# EAGLE design wgm110_dongle_v10 (EAGLE 7.7.0)
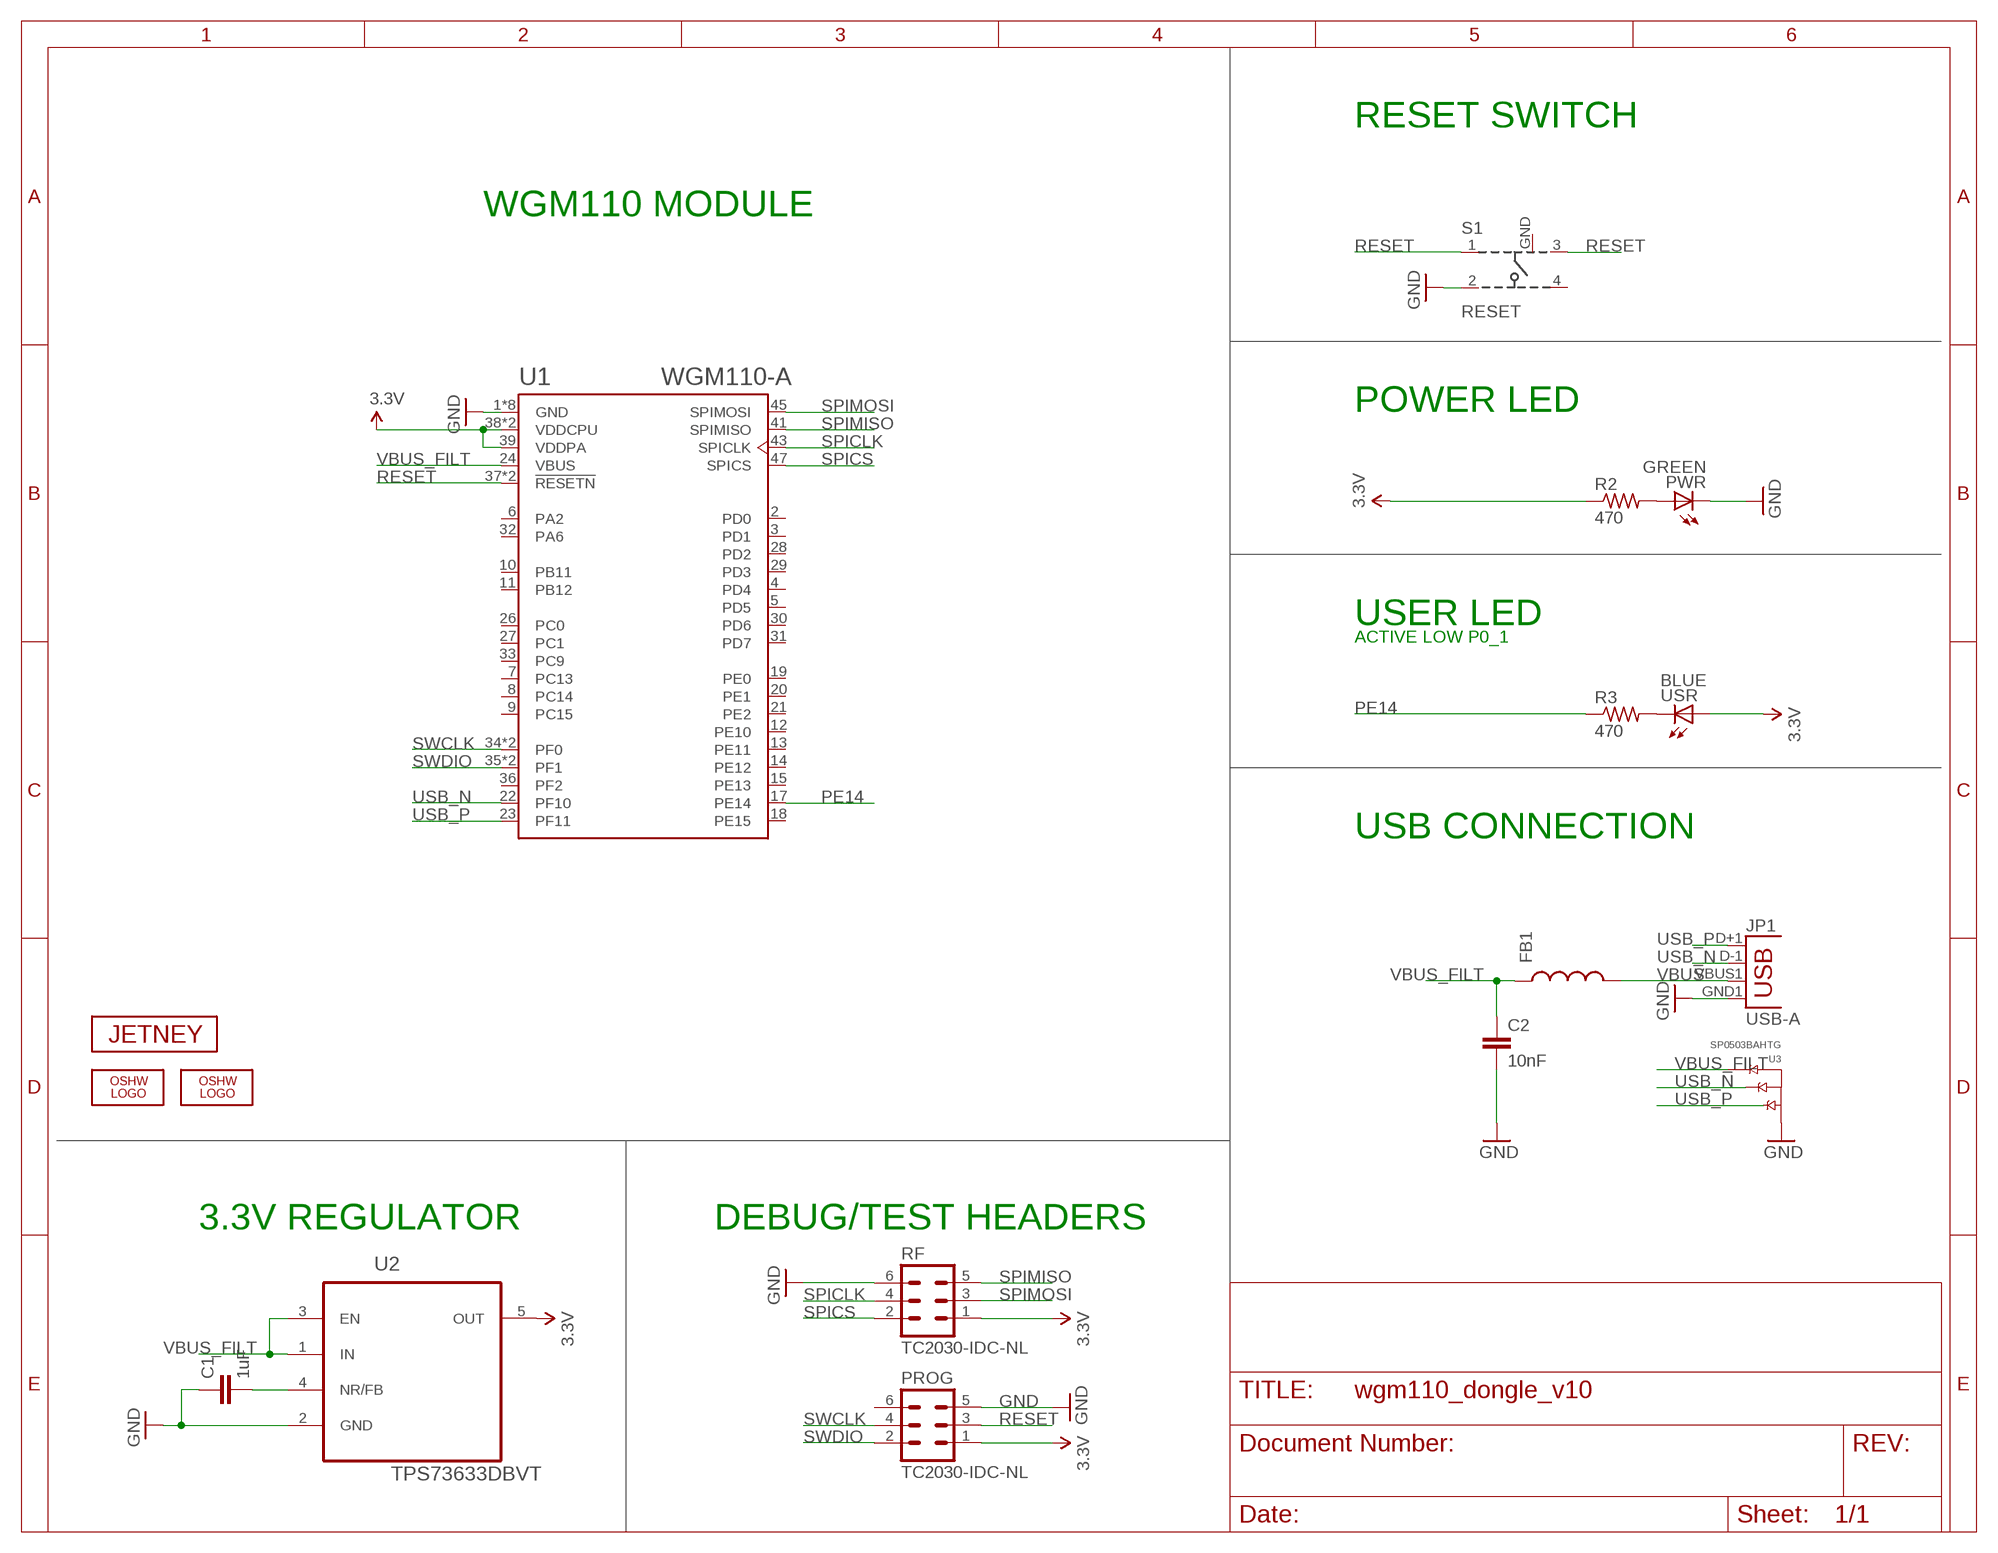
[diagram p0: schematic, sheet 1]

## Parts
C1  1uF  CAP0603-CAP  [0603-CAP]
C2  10nF  CAP0603-CAP  [0603-CAP]
FB1  INDUCTOR0805  [0805]
JP1  USB-A  USBA-SMD-MALE-MOLEX  [USB-A-SMT-MALE-MOLEX]
LOGO1  OSHW_LOGO_FILLX0100-NT  [OSHW_FILLX100_NOTEXT]
LOGO2  OSHW_LOGO_FILLX0070-NT  [OSHW_FILLX70_NOTEXT]
PROG  TC2030-IDC-NL  [TC2030-IDC-NL]
PWR  GREEN  LEDCHIPLED_0805  [CHIPLED_0805]
R2  470  R-US_R0603  [R0603]
R3  470  R-US_R0603  [R0603]
RF  TC2030-IDC-NL  [TC2030-IDC-NL]
S1  RESET  101-IG  [101-IG]
U1  WGM110-A  [WGM110-A]
U2  TPS73633DBVT  [SOT95P280X145-5N]
U3  SP0503BAHTG  [SOT143]
U$2  JETNEY-LOGO-12  [JETNEY-LOGO-12]
USR  BLUE  LEDCHIPLED_0805  [CHIPLED_0805]

## Nets
3.3V [power]: PROG.1 R2.1 RF.1 U1.38(VDDCPU) U1.39(VDDPA) U1.51(VDDCPU) U2.5(OUT) USR.A
GND [power]: C1.1 C2.2 JP1.GND1(GND) PROG.5 PWR.C RF.6 S1.2 U1.1(GND) U1.16(GND) U1.25(GND) U1.40(GND) U1.42(GND) U1.44(GND) U1.46(GND) U1.48(GND) U2.2(GND) U3.1(GND)
PE14: R3.1 U1.17(PE14)
PE14_LED: R3.2 USR.C
PWR_LED: PWR.A R2.2
REG_BP: C1.2 U2.4(NR/FB)
RESET: PROG.3 S1.1 S1.3 U1.37(!RESETN) U1.49(!RESETN)
SPICLK: RF.4 U1.43(SPICLK)
SPICS: RF.2 U1.47(SPICS)
SPIMISO: RF.5 U1.41(SPIMISO)
SPIMOSI: RF.3 U1.45(SPIMOSI)
SWCLK: PROG.4 U1.34(PF0) U1.50(PF0)
SWDIO: PROG.2 U1.35(PF1) U1.52(PF1)
USB_N: JP1.D-1(D-) U1.22(PF10) U3.3(B)
USB_P: JP1.D+1(D+) U1.23(PF11) U3.2(A)
VBUS: FB1.2 JP1.VBUS1(VBUS)
VBUS_FILT: C2.1 FB1.1 U1.24(VBUS) U2.1(IN) U2.3(EN) U3.4(C)
Unconnected: PROG.6 S1.4 U1.2(PD0) U1.3(PD1) U1.4(PD4) U1.5(PD5) U1.6(PA2) U1.7(PC13) U1.8(PC14) U1.9(PC15) U1.10(PB11) U1.11(PB12) U1.12(PE10) U1.13(PE11) U1.14(PE12) U1.15(PE13) U1.18(PE15) U1.19(PE0) U1.20(PE1) U1.21(PE2) U1.26(PC0) U1.27(PC1) U1.28(PD2) U1.29(PD3) U1.30(PD6) U1.31(PD7) U1.32(PA6) U1.33(PC9) U1.36(PF2)

## Notes on the sheet
- RESET SWITCH
- WGM110 MODULE
- POWER LED
- USER LED
- ACTIVE LOW P0_1
- USB CONNECTION
- 3.3V REGULATOR | DEBUG/TEST HEADERS

## Power pins joined to a net without a drawn wire
GND: S1.GND

## Library data of the parts
C1 C2 = SparkFun:CAP: Capacitor Standard 0603 ceramic capacitor, and 0.1" leaded capacitor.
FB1 = SparkFun-Passives:INDUCTOR: Inductors Basic Inductor/Choke - 0603 and 1206. Footprints are not proven and vary greatly between part numbers. INDUCTOR POWER 3.3UH 4.0A SMD 0.197" L x 0.197" W x 0.177" H (5.00mm x 5.00mm x 4.50mm)
JP1 = SparkFun-Connectors:USB: USB Connectors USB-B-PTH is fully proven SKU : PRT-00139/CONN-08278 USB-miniB is fully proven SKU : PRT-00587 USB-A-PCB is untested. USB-A-H is throughly reviewed, but untested. Spark Fun Electronics SKU : PRT-00437 USB-B-SMT is throughly reviewed, but untested. Needs silkscreen touching up. USB-A-S has not been used/tested USB-MB-H has not been used/tested USB-MICROB has been used. CONN-09505
LOGO1 LOGO2 = oshw-logo:OSHW_LOGO_FILL
PROG RF = TagConnect:TC2030-IDC: Tag-Connect In Circuit Programming & Debug Cable 6 Pin http://www.tag-connect.com
PWR USR = led:LED: LED OSRAM: - CHIPLED LG R971, LG N971, LY N971, LG Q971, LY Q971, LO R971, LY R971 LH N974, LH R974 LS Q976, LO Q976, LY Q976 LO Q996 - Hyper CHIPLED LW Q18S LB Q993, LB Q99A, LB R99A - SideLED LS A670, LO A670, LY A670, LG A670, LP A670 LB A673, LV A673, LT A673, LW A673 LH A674 LY A675 LS A676, LA A676, LO A676, LY A676, LW A676 LS A679, LY A679, LG A679 - Hyper Micro SIDELED® LS Y876, LA Y876, LO Y876, LY Y876 LT Y87S - SmartLED LW L88C, LW L88S LB L89C, LB L89S, LG L890 LS L89K, LO L89K, LY L89K LS L896, LA L896, LO L896, LY L896 - TOPLED LS T670, LO T670, LY T670, LG T670, LP T670 LSG T670, LSP T670, LSY T670, LOP T670, LYG T670 LG T671, LOG T671, LSG T671 LB T673, LV T673, LT T673, LW T673 LH T674 LS T676, LA T676, LO T676, LY T676, LB T676, LH T676, LSB T676, LW T676 LB T67C, LV T67C, LT T67C, LS T67K, LO T67K, LY T67K, LW E67C LS E67B, LA E67B, LO E67B, LY E67B, LB E67C, LV E67C, LT E67C LW T67C LS T679, LY T679, LG T679 LS T770, LO T770, LY T770, LG T770, LP T770 LB T773, LV T773, LT T773, LW T773 LH T774 LS E675, LA E675, LY E675, LS T675 LS T776, LA T776, LO T776, LY T776, LB T776 LHGB T686 LT T68C, LB T68C - Hyper Mini TOPLED® LB M676 - Mini TOPLED Santana® LG M470 LS M47K, LO M47K, LY M47K Source: http://www.osram.convergy.de LUXEON: - LUMILED® LXK2-PW12-R00, LXK2-PW12-S00, LXK2-PW14-U00, LXK2-PW14-V00 LXK2-PM12-R00, LXK2-PM12-S00, LXK2-PM14-U00 LXK2-PE12-Q00, LXK2-PE12-R00, LXK2-PE12-S00, LXK2-PE14-T00, LXK2-PE14-U00 LXK2-PB12-K00, LXK2-PB12-L00, LXK2-PB12-M00, LXK2-PB14-N00, LXK2-PB14-P00, LXK2-PB14-Q00 LXK2-PR12-L00, LXK2-PR12-M00, LXK2-PR14-Q00, LXK2-PR14-R00 LXK2-PD12-Q00, LXK2-PD12-R00, LXK2-PD12-S00 LXK2-PH12-R00, LXK2-PH12-S00 LXK2-PL12-P00, LXK2-PL12-Q00, LXK2-PL12-R00 Source: www.luxeon.com KINGBRIGHT: KA-3528ASYC Source: www.kingbright.com
R2 R3 = resistor:R-US_: RESISTOR, American symbol
S1 = sf-keyglove:101-IG
U1 = jetney-silabs-modules:WGM110-A
U2 = TexasInstruments:TPS73633DBVT: Cap-Free, NMOS, 400mA Low-Dropout Regulator with Reverse Current Protection; MPN: TPS73633DBVT; OC_FARNELL: 1535775; OC_NEWARK: 87H2981; PACKAGE: SOT-23-5; SUPPLIER: Texas Instruments
U3 = littlefuse:SP0503BAHTG
U$2 = sf-keyglove:JETNEY-LOGO

## Net classes
0 default: width 0.152 mm, drill 0.33 mm, clearance 0.152 mm
1 power: width 0.254 mm, drill 0.33 mm, clearance 0.152 mm

## Board
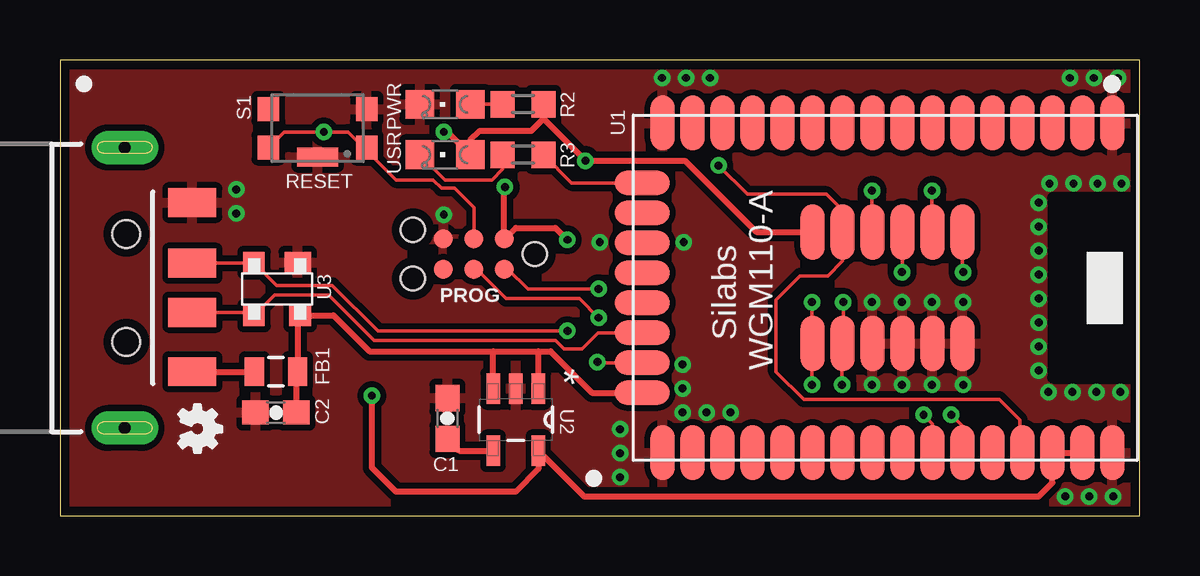
[diagram p1: board, top side]
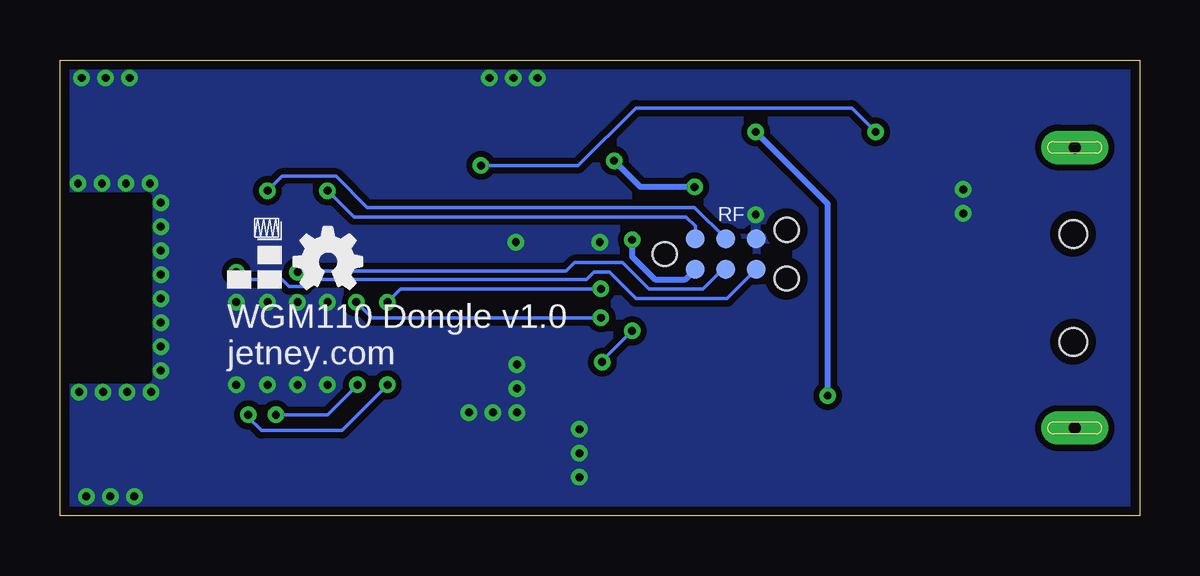
[diagram p2: board, bottom side, seen from below]

Size 45 x 19 mm. Coordinates in mm from the lower left corner, seen from the top.
Outline: 0,0 45,0 45,19 0,19 0,0
Copper layers (1*16): Top 0.0356mm / dielectric 1.5011mm / Bottom 0.0356mm
Design rules "default": minimum track width 6mil, minimum drill 13mil, track to track 6mil, track to pad 6mil, pad to pad 6mil, via to via 6mil, smd to smd 6mil, copper to edge 15mil, drill to drill 6mil, minimum pad ring 7mil, minimum via ring 7mil, stop-mask expansion 4mil, vias tented up to drill 13mil, thermal gap 10mil

### Footprints (pad centres in the part's own frame; a part is rotated, then mirrored left to right if it is on the bottom)
0603-CAP = smd 1.1 x 1: 1 -0.85,0; 2 0.85,0
0805 = smd 0.8 x 1.2: 1 -0.9,0; 2 0.9,0
USB-A-SMT-MALE-MOLEX = smd 1.2 x 2: D+1 1.027,-5.87; D-1 -1.027,-5.87; GND1 3.551,-5.87; VBUS1 -3.5,-5.87 | drill 0.5 pad 1.4 long: P$1 5.85,-3.05; P$3 -5.85,-3.05 | hole 1.15: 2.25,-3.12; -2.25,-3.12
TC2030-IDC-NL = smd 0.787 x 0.787: 1 -1.27,-0.635; 2 -1.27,0.635; 3 0,-0.635; 4 0,0.635; 5 1.27,-0.635; 6 1.27,0.635 | hole 0.991: -2.54,0; 2.54,1.016; 2.54,-1.016
CHIPLED_0805 = smd 1.2 x 1.2: A 0,-1.05; C 0,1.05
R0603 = smd 1 x 1.1: 1 -0.85,0; 2 0.85,0
101-IG = smd 0.9 x 1: 1 -2.05,0.8; 2 -2.05,-0.8; 3 2.05,0.8; 4 2.05,-0.8 | smd 1.7 x 0.8: GND 0,1.2
WGM110-A = smd 2.3 x 1: 1 -6.875,9.47; 2 -6.875,8.22; 3 -6.875,6.97; 4 -6.875,5.72; 5 -6.875,4.47; 6 -6.875,3.22; 7 -6.875,1.97; 8 -6.875,0.72; 9 -6.875,-0.53; 10 -6.875,-1.78; 11 -6.875,-3.03; 12 -6.875,-4.28; 13 -6.875,-5.53; 14 -6.875,-6.78; 15 -6.875,-8.03; 16 -6.875,-9.28; 25 6.875,-9.28; 26 6.875,-8.03; 27 6.875,-6.78; 28 6.875,-5.53; 29 6.875,-4.28; 30 6.875,-3.03; 31 6.875,-1.78; 32 6.875,-0.53; 33 6.875,0.72; 34 6.875,1.97; 35 6.875,3.22; 36 6.875,4.47; 37 6.875,5.72; 38 6.875,6.97; 39 6.875,8.22; 40 6.875,9.47; 41 -2.325,3.22; 42 2.325,3.22; 43 -2.325,1.97; 44 2.325,1.97; 45 -2.325,0.72; 46 2.325,0.72; 47 -2.325,-0.53; 48 2.325,-0.53; 49 -2.325,-1.78; 50 2.325,-1.78; 51 -2.325,-3.03; 52 2.325,-3.03 | smd 1 x 2.3: 17 -4.375,-10.13; 18 -3.125,-10.13; 19 -1.875,-10.13; 20 -0.625,-10.13; 21 0.625,-10.13; 22 1.875,-10.13; 23 3.125,-10.13; 24 4.375,-10.13
SOT95P280X145-5N = smd 1.27 x 0.559: 1 -1.295,0.94; 2 -1.295,0; 3 -1.295,-0.94; 4 1.295,-0.94; 5 1.295,0.94
SOT143 = smd 0.9 x 1.1: 1 -1.1,0.86 | smd 0.9 x 0.9: 2 -1.1,-0.96; 3 1.1,-0.96; 4 1.1,0.96

### Placement (x,y rotation side)
C1  16.15,4.05 270 top
C2  9,4.3 180 top
FB1  9,6 180 top
JP1  -0.35,9.5 90 top
LOGO1  35.24,9.46 0 bottom
LOGO2  4.96,4.61 270 top
PROG  17.25,10.9 180 top
PWR  16.05,17.15 90 top
R2  19.3,17.15 180 top
R3  19.3,15.05 180 top
RF  17.25,10.9 0 bottom
S1  10.74,16.15 180 top
U1  34.4,9.5 270 top
U2  19,4 270 top
U3  9.05,9.45 270 top
U$2  38.04,9.46 0 bottom
USR  16.05,15.05 90 top

### Tracks (layer width: path | path; a pad name or v marks a point on that pad's centre or on a via)
3.3V  (via drill 0.33)
  Top 0.254: U1.39 U1.38 41.37,1.37 40.8,0.8 21.84,0.8 U2.5 19.94,1.94 19,1 14,1 13,2 v13,5 | 20.15,16.55 19.65,16.05 17.5,16.05 17.1,15.65 USR.A 16.15,16 v16,16 | 20.15,16.55 R2.1 | 20.15,16.55 v21.9,14.8 26.05,14.8 29.02,11.82 U1.51 | v18.55,13.7 18.52,13.67 PROG.1 18.54,11.54 19,12 20.65,12 v21.15,11.5
  Bottom 0.254: 22,14.7 v21.9,14.8 20.8,13.7 v18.55,13.7 | v13,5 13,13 v16,16 | v21.15,11.5 21.15,10.8 20.2,9.85 18.93,9.85 RF.1
GND  (via drill 0.33)
  other vias: 23.35,2.6 23.35,3.6 23.35,1.6 7.35,13.6 7.35,12.6 44.25,13.85 43.25,13.85 42.25,13.85 41.25,13.85 40.8,13.05 40.8,12.05 40.8,11.05 40.8,10.05 40.8,9.05 40.8,8.05 40.8,7.05 40.8,6.05 41.2,5.15 42.2,5.15 43.2,5.15 44.2,5.15 25.95,4.3 26.95,4.3 27.95,4.3 25.95,5.3 25.95,6.3 25.1,18.25 26.1,18.25 27.1,18.25 44.1,18.25 43.1,18.25 42.1,18.25 43.9,0.8 42.9,0.8 41.9,0.8 37.65,8.9 36.35,8.9 35.1,8.9 33.85,8.9 37.65,5.45 36.35,5.45 35.1,5.45 33.85,5.45 26,11.4 22.5,11.4 16,12.55
  pour Bottom (isolate 0.254): 0,0 45,0 45,19 0,19
  pour Top (isolate 0.254): 0,0 45,0 45,19 0,19
PE14
  Top 0.152: R3.1 21.32,13.88 U1.17
PE14_LED
  Top 0.152: USR.C 16.05,14 18,14 18.45,14.45 R3.2
PWR_LED
  Top 0.152: PWR.A R2.2
REG_BP
  Top 0.254: C1.2 16.64,2.71 U2.4
RESET  (via drill 0.33)
  Top 0.152: U1.37 40,2.75 40,4 39.15,4.85 31,4.85 29.85,6 29.85,9 30.85,10 32,10 32.62,10.62 U1.49 32.62,12.73 31.95,13.4 28.65,13.4 v27.45,14.6 | S1.3 9.34,16 v11,16 12,16 12.65,15.35 S1.1 12.79,15.21 14,14 15.55,14 15.9,13.65 16.45,13.65 17.25,12.85 PROG.3
  Bottom 0.152: v27.45,14.6 23.4,14.6 21,17 12,17 v11,16
SPICLK  (via drill 0.33)
  Top 0.152: v36.35,13.55 36.35,11.85 U1.43
  Bottom 0.152: RF.4 18.55,12.85 32.2,12.85 33.5,14.15 35.75,14.15 v36.35,13.55
SPICS  (via drill 0.33)
  Top 0.152: v33.85,13.55 33.85,11.85 U1.47
  Bottom 0.152: RF.2 18.52,12.07 18.9,12.45 32.75,12.45 v33.85,13.55
SPIMISO  (via drill 0.33)
  Top 0.152: U1.41 37.62,10.18 v37.65,10.15
  Bottom 0.152: v37.65,10.15 37.65,10.05 37.45,9.85 35.75,9.85 35.45,9.55 34.8,9.55 34.5,9.85 23.05,9.85 22.75,10.15 22.1,10.15 21,9.05 17.2,9.05 RF.5
SPIMOSI  (via drill 0.33)
  Top 0.152: U1.45 35.12,10.17 v35.1,10.15
  Bottom 0.152: RF.3 17.39,10.27 18.2,9.45 20.45,9.45 21.55,10.55 23.55,10.55 23.9,10.2 35.05,10.2 v35.1,10.15
SWCLK  (via drill 0.33)
  Top 0.152: v32.6,5.45 32.6,7.16 U1.50 32.65,7.21 v32.65,8.9 | v36,4.2 36.37,3.83 U1.34 | PROG.4 17.39,10.27 18.6,9.05 21.65,9.05 v22.45,8.25
  Bottom 0.152: v32.6,5.45 33.85,4.2 v36,4.2 | v22.45,8.25 32,8.25 v32.65,8.9
SWDIO  (via drill 0.33)
  Top 0.152: v31.35,5.45 31.35,7.16 U1.52 31.35,7.2 v31.35,8.9 | v37.15,4.2 37.62,3.73 U1.35 | PROG.2 18.68,10.27 19.5,9.45 v22.45,9.45
  Bottom 0.152: v31.35,5.45 33.25,3.55 36.6,3.55 37.15,4.1 v37.15,4.2 | v22.45,9.45 30.8,9.45 v31.35,8.9
USB_N
  Top 0.152: JP1.D-1 8.09,8.47 U3.3 8.94,9.2 11.2,9.2 13.1,7.3 20.65,7.3 21,6.95 21.75,6.95 22.43,7.62 U1.22
USB_P  (via drill 0.33)
  Top 0.152: JP1.D+1 8.09,10.53 U3.2 9.04,9.6 11.35,9.6 13.25,7.7 v21.15,7.7 | v22.4,6.4 22.43,6.38 U1.23
  Bottom 0.152: v21.15,7.7 22.4,6.45 v22.4,6.4
VBUS
  Top 0.254: JP1.VBUS1 FB1.2
VBUS_FILT
  Top 0.254: 18.06,6.85 12.9,6.85 11.4,8.35 U3.4 9.9,8.24 FB1.1 9.85,5.95 C2.1 | 18.06,6.85 19.94,6.85 | 19.94,6.85 20.45,6.85 22.18,5.12 U1.24 | U2.3 18.06,6.85 | U2.1 19.94,6.85

### Text on the board
tPlace: RESET | Silabs | WGM110-A
bPlace: WGM110 Dongle v1.0 | jetney.com